# EasyEDA schematic SCH_全分立 LM393_2022-09-28.json
TITLE: LM393; REV: 1.0; Date: 2022-06-28; Sheet: 1/1; Drawn By: BH2VGM; Company: NEU-ISE
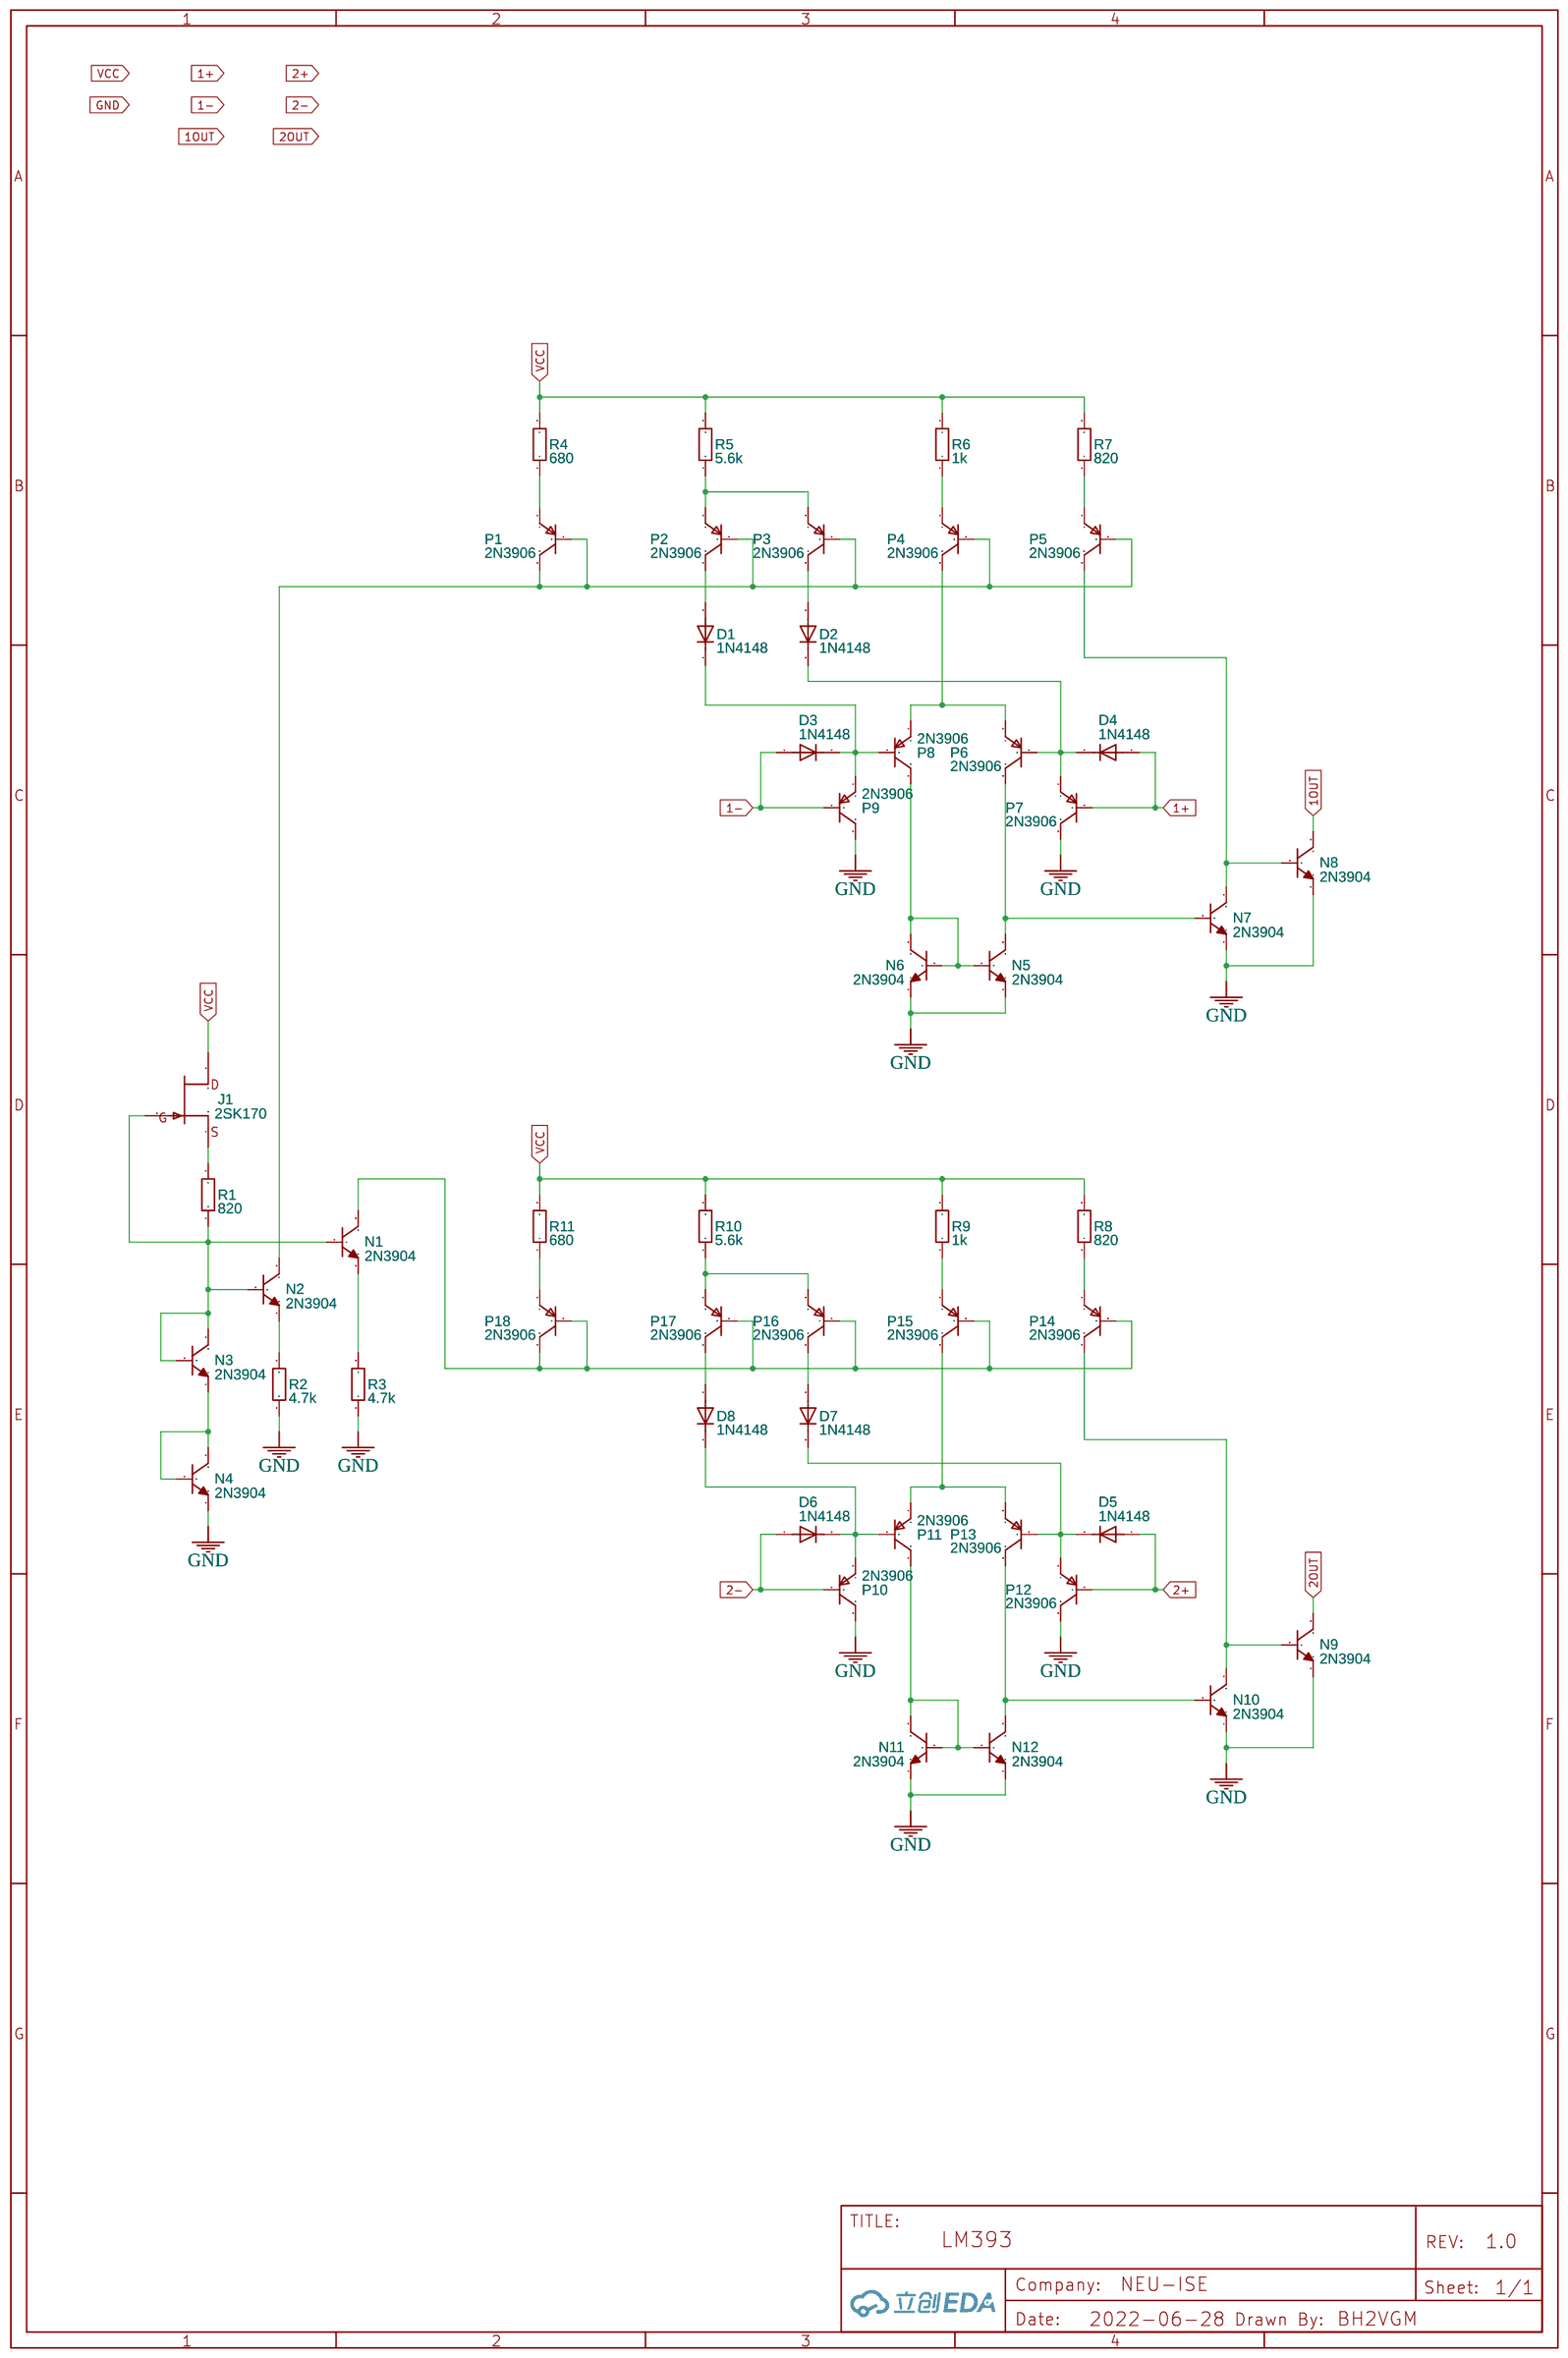
[diagram p0: schematic sheet]

## Parts
D1  1N4148  [1N4148-V]
D2  1N4148  [1N4148-V]
D3  1N4148  [1N4148-V]
D4  1N4148  [1N4148-V]
D5  1N4148  [1N4148-V]
D6  1N4148  [1N4148-V]
D7  1N4148  [1N4148-V]
D8  1N4148  [1N4148-V]
J1  2SK170  [2SK170]
N1  2N3904  [TO-92-3_L5.1-W4.1-P1.27-L]
N2  2N3904  [TO-92-3_L5.1-W4.1-P1.27-L]
N3  2N3904  [TO-92-3_L5.1-W4.1-P1.27-L]
N4  2N3904  [TO-92-3_L5.1-W4.1-P1.27-L]
N5  2N3904  [TO-92-3_L5.1-W4.1-P1.27-L]
N6  2N3904  [TO-92-3_L5.1-W4.1-P1.27-L]
N7  2N3904  [TO-92-3_L5.1-W4.1-P1.27-L]
N8  2N3904  [TO-92-3_L5.1-W4.1-P1.27-L]
N9  2N3904  [TO-92-3_L5.1-W4.1-P1.27-L]
N10  2N3904  [TO-92-3_L5.1-W4.1-P1.27-L]
N11  2N3904  [TO-92-3_L5.1-W4.1-P1.27-L]
N12  2N3904  [TO-92-3_L5.1-W4.1-P1.27-L]
P1  2N3906  [TO-92-3_L4.9-W3.7-P1.27-L]
P2  2N3906  [TO-92-3_L4.9-W3.7-P1.27-L]
P3  2N3906  [TO-92-3_L4.9-W3.7-P1.27-L]
P4  2N3906  [TO-92-3_L4.9-W3.7-P1.27-L]
P5  2N3906  [TO-92-3_L4.9-W3.7-P1.27-L]
P6  2N3906  [TO-92-3_L4.9-W3.7-P1.27-L]
P7  2N3906  [TO-92-3_L4.9-W3.7-P1.27-L]
P8  2N3906  [TO-92-3_L4.9-W3.7-P1.27-L]
P9  2N3906  [TO-92-3_L4.9-W3.7-P1.27-L]
P10  2N3906  [TO-92-3_L4.9-W3.7-P1.27-L]
P11  2N3906  [TO-92-3_L4.9-W3.7-P1.27-L]
P12  2N3906  [TO-92-3_L4.9-W3.7-P1.27-L]
P13  2N3906  [TO-92-3_L4.9-W3.7-P1.27-L]
P14  2N3906  [TO-92-3_L4.9-W3.7-P1.27-L]
P15  2N3906  [TO-92-3_L4.9-W3.7-P1.27-L]
P16  2N3906  [TO-92-3_L4.9-W3.7-P1.27-L]
P17  2N3906  [TO-92-3_L4.9-W3.7-P1.27-L]
P18  2N3906  [TO-92-3_L4.9-W3.7-P1.27-L]
R1  820  [R0805]
R2  4.7k  [R0805]
R3  4.7k  [R0805]
R4  680  [R0805]
R5  5.6k  [R0805]
R6  1k  [R0805]
R7  820  [R0805]
R8  820  [R0805]
R9  1k  [R0805]
R10  5.6k  [R0805]
R11  680  [R0805]

## Library data of the parts
D1-D8 = 1N4148 DO-35: Contributor: king13478509115
J1 = 2SK170: Contributor: king13478509115
N1-N12 = 2N3904: Supplier: LCSC; Manufacturer: SEMTECH; Supplier Part: C118538; JLCPCB Part Class: Extended Part
P1-P18 = 2N3906: Supplier: LCSC; Manufacturer: CJ; Supplier Part: C9809; JLCPCB Part Class: Extended Part
R1-R11 = TR0805D220KP0550Z: Contributor: LCSC

## Nets
GND: N4.1(E) N5.1(E) N6.1(E) N7.1(E) N8.1(E) N9.1(E) N10.1(E) N11.1(E) N12.1(E) P7.3(C) P9.3(C) P10.3(C) P12.3(C) R2.1 R3.1
VCC: J1.3(D) R4.2 R5.2 R6.2 R7.2 R8.2 R9.2 R10.2 R11.2
1+: D4.1 P7.2(B)
1-: D3.1 P9.2(B)
1OUT: N8.3(C)
2+: D5.1 P12.2(B)
2-: D6.1 P10.2(B)
2OUT: N9.3(C)
Net-(D1-1): D1.1 P2.3(C)
Net-(D1-2): D1.2 D3.2 P8.2(B) P9.1(E)
Net-(D2-1): D2.1 P3.3(C)
Net-(D2-2): D2.2 D4.2 P6.2(B) P7.1(E)
Net-(D5-2): D5.2 D7.2 P12.1(E) P13.2(B)
Net-(D6-2): D6.2 D8.2 P10.1(E) P11.2(B)
Net-(D7-1): D7.1 P16.3(C)
Net-(D8-1): D8.1 P17.3(C)
Net-(J1-1): J1.1(S) R1.2
Net-(J1-2): J1.2(G) N1.2(B) N2.2(B) N3.2(B) N3.3(C) R1.1
Net-(N1-1): N1.1(E) R3.2
Net-(N1-3): N1.3(C) P14.2(B) P15.2(B) P16.2(B) P17.2(B) P18.2(B) P18.3(C)
Net-(N2-1): N2.1(E) R2.2
Net-(N2-3): N2.3(C) P1.2(B) P1.3(C) P2.2(B) P3.2(B) P4.2(B) P5.2(B)
Net-(N3-1): N3.1(E) N4.2(B) N4.3(C)
Net-(N5-2): N5.2(B) N6.2(B) N6.3(C) P8.3(C)
Net-(N5-3): N5.3(C) N7.2(B) P6.3(C)
Net-(N7-3): N7.3(C) N8.2(B) P5.3(C)
Net-(N9-2): N9.2(B) N10.3(C) P14.3(C)
Net-(N10-2): N10.2(B) N12.3(C) P13.3(C)
Net-(N11-2): N11.2(B) N11.3(C) N12.2(B) P11.3(C)
Net-(P1-1): P1.1(E) R4.1
Net-(P2-1): P2.1(E) P3.1(E) R5.1
Net-(P4-1): P4.1(E) R6.1
Net-(P4-3): P4.3(C) P6.1(E) P8.1(E)
Net-(P5-1): P5.1(E) R7.1
Net-(P11-1): P11.1(E) P13.1(E) P15.3(C)
Net-(P14-1): P14.1(E) R8.1
Net-(P15-1): P15.1(E) R9.1
Net-(P16-1): P16.1(E) P17.1(E) R10.1
Net-(P18-1): P18.1(E) R11.1
